# Altium schematic sheet obc_imu.SchDoc
size A
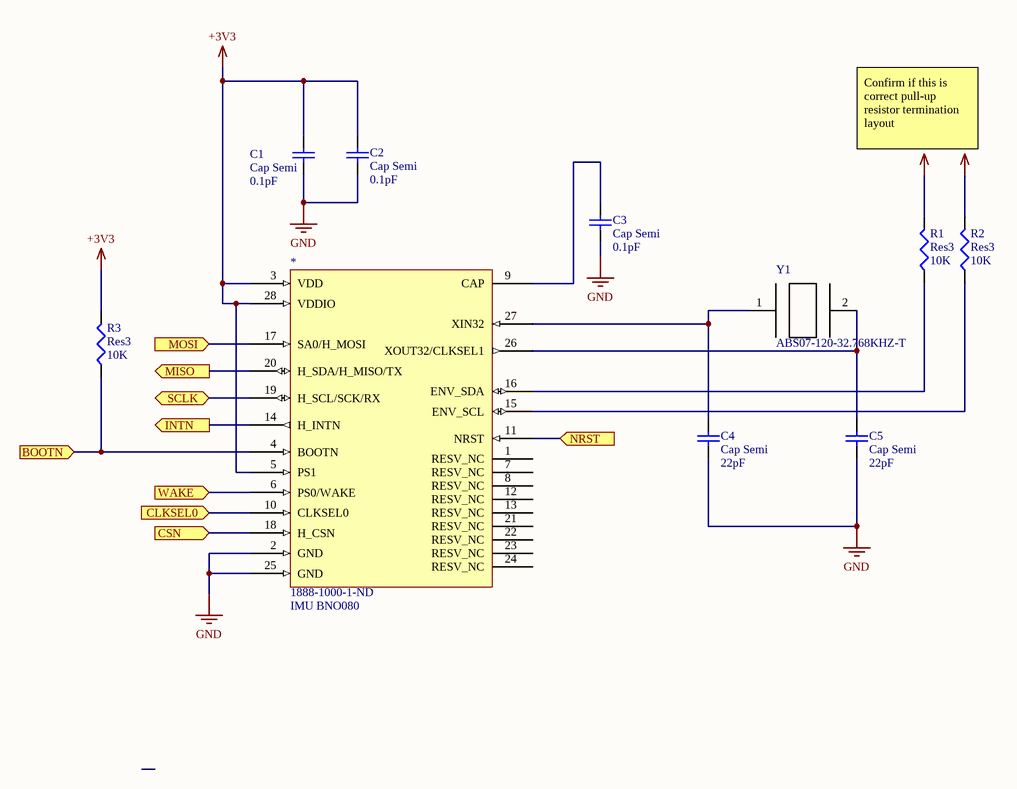
[diagram p0: obc_imu.SchDoc]

## Parts
*  IMU BNO080  [LGA-28]
C1  Cap Semi  value 0.1pF  [1608[0603]]
C2  Cap Semi  value 0.1pF  [1608[0603]]
C3  Cap Semi  value 0.1pF  [1608[0603]]
C4  Cap Semi  value 22pF  [1608[0603]]
C5  Cap Semi  value 22pF  [1608[0603]]
R1  Res3  value 10K  [J1-0603]
R2  Res3  value 10K  [J1-0603]
R3  Res3  value 10K  [J1-0603]
Y1  ABS07-120-32.768KHZ-T  [XTAL_ABS07-120-32.768KHZ-T]

## Ports
BOOTN (in), CLKSEL0 (in), CSN (in), INTN (out), MISO (out), MOSI (in), NRST (in), SCLK (bidir), WAKE (in)

## Nets
+3V3: *.3(VDD) *.5(PS1) *.28(VDDIO) C1.2 C2.2 R1.2 R2.2 R3.2
GND: *.2(GND) *.25(GND) C1.1 C2.1 C3.1 C4.1 C5.1
BOOTN: *.4(BOOTN) R3.1 ; port BOOTN
CLKSEL0: *.10(CLKSEL0) ; port CLKSEL0
CSN: *.18(H_CSN) ; port CSN
INTN: *.14(H_INTN) ; port INTN
MISO: *.20(H_SDA/H_MISO/TX) ; port MISO
MOSI: *.17(SA0/H_MOSI) ; port MOSI
NRST: *.11(NRST) ; port NRST
SCLK: *.19(H_SCL/SCK/RX) ; port SCLK
WAKE: *.6(PS0/WAKE) ; port WAKE
Net*_9: *.9(CAP) C3.2
Net*_15: *.15(ENV_SCL) R2.1
Net*_16: *.16(ENV_SDA) R1.1
Net*_26: *.26(XOUT32/CLKSEL1) C5.2 Y1.2
Net*_27: *.27(XIN32) C4.2 Y1.1

Not connected (* = marked no-connect by the designer): * 1(RESV_NC) 7(RESV_NC) 8(RESV_NC) 12(RESV_NC) 13(RESV_NC) 21(RESV_NC) 22(RESV_NC) 23(RESV_NC) 24(RESV_NC)

## Notes on the sheet
- Confirm if this is correct pull-up resistor termination layout
- (in symbol IMU BNO080) 1888-1000-1-ND

## Library data of the parts
* = IMU BNO080: ACCEL/GYRO/MAG I2C 32BIT
C1-C5 = Cap Semi: Capacitor (Semiconductor SIM Model); Published: 8-Jun-2000; LatestRevisionDate: 29-May-2009; LatestRevisionNote: IPC-7351 Footprint Added.; PackageReference: C1206; Publisher: Altium Limited; PackageDescription: Chip Capacitor
R1-R3 = Res3: Resistor; Published: 8-Jun-2000; LatestRevisionDate: 29-May-2009; LatestRevisionNote: IPC-7351 Footprint Added.; PackageReference: J1-0603; Publisher: Altium Limited; PackageDescription: Chip Resistor
Y1 = ABS07-120-32.768KHZ-T: 3.2 x 1.5mm, 32.768KHZ Xtal 6pf, 20ppm, -40+85C, ESR 60kOhm, ST Micro Ref Design Crystal for STM32L; MF: Abracon; MP: ABS07-120-32.768KHZ-T; SnapEDA_Link: https://www.snapeda.com/parts/ABS07-120-32.768KHZ-T/Abracon%20LLC/view-part/?ref=snap; Package: SMD-2 Abracon; Price: 0.37 USD; Availability: Good; Value: *